# EAGLE design proj_controle (EAGLE 7.6.0)
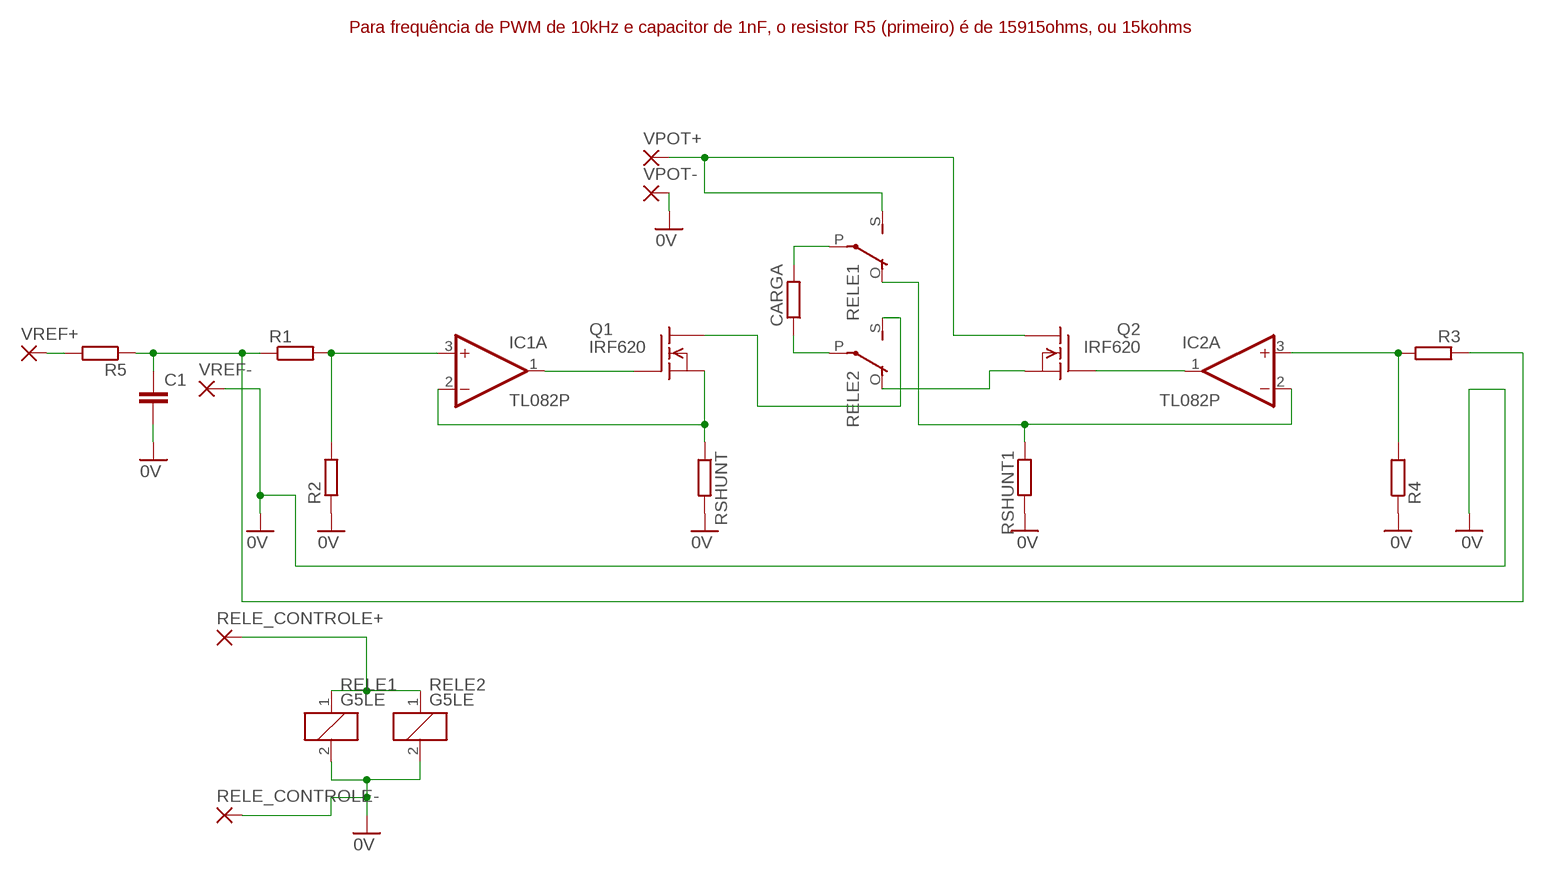
[diagram p0: schematic, sheet 1]

## Parts
C1  C-EU050-025X075  [C050-025X075]
CARGA  R-EU_0207/10  [0207/10]
IC1  TL082P  [DIL08]
IC2  TL082P  [DIL08]
Q1  IRF620  [TO220]
Q2  IRF620  [TO220]
R1  R-EU_0207/10  [0207/10]
R2  R-EU_0207/10  [0207/10]
R3  R-EU_0207/10  [0207/10]
R4  R-EU_0207/10  [0207/10]
R5  R-EU_0207/10  [0207/10]
RELE1  G5LE  [G5LE]
RELE2  G5LE  [G5LE]
RELE_CONTROLE+  3,17/1,1  [3,17/1,1]
RELE_CONTROLE-  3,17/1,1  [3,17/1,1]
RSHUNT  R-EU_0617/22  [0617/22]
RSHUNT1  R-EU_0617/22  [0617/22]
VPOT+  3,17/1,1  [3,17/1,1]
VPOT-  3,17/1,1  [3,17/1,1]
VREF+  3,17/1,1  [3,17/1,1]
VREF-  3,17/1,1  [3,17/1,1]

## Nets
0V: C1.2 R2.1 R4.1 RELE1.2 RELE2.2 RELE_CONTROLE-.1(P) RSHUNT1.2 RSHUNT.2 VPOT-.1(P) VREF-.1(P)
N$1: CARGA.1 RELE2.P(2:P)
N$2: IC1.3(A:+IN) R1.2 R2.2
N$3: IC1.1(A:OUT) Q1.1(G)
N$4: IC1.2(A:-IN) Q1.3(S) RSHUNT.1
N$5: C1.1 R1.1 R3.1 R5.1
N$6: R5.2 VREF+.1(P)
N$7: CARGA.2 RELE1.P(2:P)
N$8: Q1.2(D) RELE2.S(2:S)
N$9: IC2.3(A:+IN) R3.2 R4.2
N$10: IC2.1(A:OUT) Q2.1(G)
N$11: IC2.2(A:-IN) RELE1.O(2:O) RSHUNT1.1
N$13: Q2.2(D) RELE1.S(2:S) VPOT+.1(P)
N$14: Q2.3(S) RELE2.O(2:O)
N$15: RELE1.1 RELE2.1 RELE_CONTROLE+.1(P)
Unconnected: IC1.5(B:+IN) IC1.6(B:-IN) IC1.7(B:OUT) IC2.5(B:+IN) IC2.6(B:-IN) IC2.7(B:OUT)

## Notes on the sheet
- Para frequência de PWM de 10kHz e capacitor de 1nF, o resistor R5 (primeiro) é de 15915ohms, ou 15kohms

## Power pins joined to a net without a drawn wire
V+: IC1.8(P:V+) IC2.8(P:V+)
V-: IC1.4(P:V-) IC2.4(P:V-)

## Library data of the parts
C1 = rcl:C-EU: CAPACITOR, European symbol
CARGA R1-R5 = rcl:R-EU_: RESISTOR, European symbol
IC1 IC2 = linear:TL082: OP AMP Data sheet <http://www.ti.com/lit/ds/symlink/tl084a . pdf>; DATA_SHEET: <a href="http://www.ti.com/lit/ds/symlink/tl084a.pdf"> Data sheet </a>
Q1 Q2 = transistor-fet:IRF620: N-Channel Enhancement MOSFET (HEXFET); 200V; 5,2A; 0,8Ohm
RELE1 RELE2 = relay:G5LE: RELAY 1 x switch, 10 A/120 V AC, 8 A/30 V DC, Omron; OC_FARNELL: unknown; OC_NEWARK: unknown
RELE_CONTROLE+ RELE_CONTROLE- VPOT+ VPOT- VREF+ VREF- = wirepad:3,17/1,1: THROUGH-HOLE PAD
RSHUNT RSHUNT1 = resistor:R-EU_: RESISTOR, European symbol

## Board
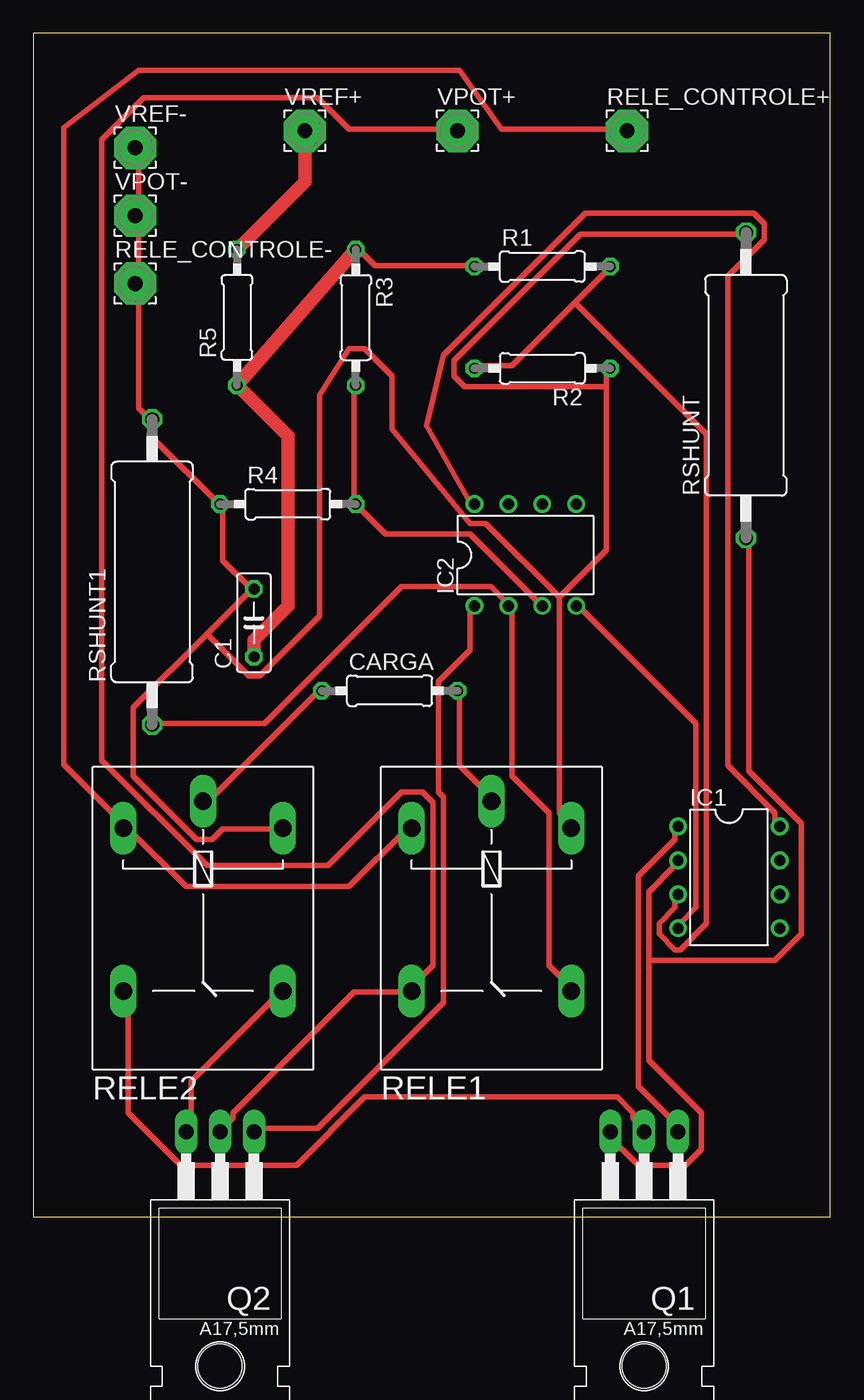
[diagram p1: board, top side]

Size 59.67 x 88.57 mm. Coordinates in mm from the lower left corner, seen from the top.
Outline: 0,0 59.67,0 59.67,88.57 0,88.57 0,0
Copper layers (1*16): Top 0.035mm / dielectric 1.5mm / Bottom 0.035mm
Design rules "default *": minimum track width 16mil, minimum drill 24mil, track to track 15mil, track to pad 15mil, pad to pad 15mil, via to via 15mil, smd to smd 8mil, copper to edge 40mil, drill to drill 8mil, minimum pad ring 10mil, minimum via ring 8mil, stop-mask expansion 4mil, vias tented up to drill 0mil, thermal gap 10mil

### Footprints (pad centres in the part's own frame; a part is rotated, then mirrored left to right if it is on the bottom)
C050-025X075 = drill 0.813 octagon: 1 -2.54,0; 2 2.54,0
0207/10 = drill 0.813 octagon: 1 -5.08,0; 2 5.08,0
DIL08 = drill 0.813 pad 1.27: 1 -3.81,-3.81; 2 -1.27,-3.81; 3 1.27,-3.81; 4 3.81,-3.81; 5 3.81,3.81; 6 1.27,3.81; 7 -1.27,3.81; 8 -3.81,3.81
TO220 = drill 1.118 long: 1 -2.54,-6.35; 2 0,-6.35; 3 2.54,-6.35 | hole 3.302: 0,11.176
G5LE = drill 1.321 long: 1 -7.493,-5.969; 2 -7.493,5.969; O 4.699,5.969; P -9.525,0; S 4.699,-5.969
3,17/1,1 = drill 1.118 pad 3.175 octagon: 1 0,0
0617/22 = drill 1.016 octagon: 1 -11.43,0; 2 11.43,0

### Placement (x,y rotation side)
C1  16.51,44.45 90 top
CARGA  26.67,39.37 0 top
IC1  52.07,25.4 270 top
IC2  36.83,49.53 0 top
Q1  45.72,0 180 top
Q2  13.97,0 180 top
R1  38.1,71.12 0 top
R2  38.1,63.5 180 top
R3  24.13,67.31 270 top
R4  19.05,53.34 0 top
R5  15.24,67.31 90 top
RELE1  34.29,21.59 270 top
RELE2  12.7,21.59 270 top
RELE_CONTROLE+  44.45,81.28 0 top
RELE_CONTROLE-  7.62,69.85 0 top
RSHUNT  53.34,62.23 90 top
RSHUNT1  8.89,48.26 90 top
VPOT+  31.75,81.28 0 top
VPOT-  7.62,74.93 0 top
VREF+  20.32,81.28 0 top
VREF-  7.62,80.01 0 top

### Tracks (layer width: path | path; a pad name or v marks a point on that pad's centre or on a via)
0V
  Top 0.406: 42.91,62.12 42.91,49.91 39.37,46.37 | 42.91,62.12 42.91,63.3 R2.1 | 39.37,46.37 39.37,30.23 40.16,29.44 RELE1.2 | 42.91,62.12 32.28,62.12 31.5,62.9 31.5,64.08 40.95,73.53 53.15,73.53 RSHUNT.2 | VREF-.1 7.87,79.83 7.87,75.11 VPOT-.1 7.87,74.71 7.87,69.99 RELE_CONTROLE-.1 7.87,69.6 7.87,60.54 8.66,59.75 RSHUNT1.2 9.05,59.36 9.05,58.18 13.78,53.45 R4.1 14.17,53.06 14.17,49.12 16.14,47.15 C1.2 16.14,46.76 12.99,43.61 | 12.99,43.61 7.48,38.1 7.48,32.98 12.21,28.26 13.39,28.26 14.17,29.05 18.5,29.05 RELE2.2 | 39.37,46.37 33.86,51.88 32.68,51.88 26.86,58.97 26.86,62.9 24.8,64.96 23.62,64.96 21.44,61.51 21.44,44.97 16.93,40.46 16.14,40.46 12.99,43.61
N$1
  Top 0.406: CARGA.1 21.26,39.28 12.99,31.01 RELE2.P
N$2
  Top 0.406: 40.55,68.42 42.91,70.78 R1.2 | 40.55,68.42 35.83,63.69 33.07,63.69 R2.2 | 40.55,68.42 50.39,58.57 50.39,21.96 48.42,19.99 48.03,19.99 46.85,21.17 46.85,21.96 48.03,23.14 48.03,23.93 IC1.3
N$3
  Top 0.406: IC1.1 48.03,29.05 48.03,28.26 45.28,25.5 45.28,9.75 48.42,6.6 Q1.1
N$4
  Top 0.406: 46.06,19.2 46.06,11.72 50,7.79 50,5.03 48.82,3.85 45.28,3.85 42.91,6.21 Q1.3 | 46.06,19.2 46.06,24.32 48.03,26.29 IC1.2 | 46.06,19.2 55.51,19.2 57.48,21.17 57.48,29.44 53.54,33.38 53.54,50.7 RSHUNT.1
N$5
  Top 0.406: R1.1 32.68,71.17 25.59,71.17 24.41,72.35 R3.1
  Top 1.016: R3.1 R5.1 19.05,58.42 19.05,45.72 16.51,43.18 C1.1
N$6
  Top 1.016: VREF+.1 20.32,77.47 R5.2
N$7
  Top 0.406: CARGA.2 31.89,39.28 31.89,33.77 34.25,31.41 RELE1.P
N$8
  Top 0.406: Q1.2 45.67,6.6 44.88,7.39 44.88,7.79 43.7,8.97 24.8,8.97 19.68,3.85 11.02,3.85 7.09,7.79 7.09,16.84 RELE2.S
N$9
  Top 0.406: R3.2 24.02,62.12 24.02,53.45 R4.2 26.38,51.09 32.68,51.09 37.8,45.97 IC2.3
N$10
  Top 0.406: IC2.1 32.68,45.58 32.68,42.43 30.32,40.07 30.32,31.8 30.71,31.41 30.71,16.05 21.26,6.6 16.54,6.6 Q2.1
N$11
  Top 0.406: RELE1.O 40.16,17.23 38.58,18.81 38.58,30.23 35.83,32.98 35.83,45.58 IC2.2 35.43,45.97 34.25,47.15 27.56,47.15 17.32,36.92 9.05,36.92 RSHUNT1.1
N$13
  Top 0.406: Q2.2 14.17,6.6 14.96,7.39 14.96,7.79 24.02,16.84 27.95,16.84 RELE1.S 28.35,17.23 29.92,18.81 29.92,31.01 29.13,31.8 27.56,31.8 22.05,26.29 12.99,26.29 5.12,34.16 5.12,80.62 8.27,83.77 21.26,83.77 23.62,81.41 31.5,81.41 VPOT+.1
N$14
  Top 0.406: Q2.3 11.81,6.6 11.81,10.15 18.5,16.84 RELE2.O
N$15
  Top 0.406: RELE1.1 27.95,29.05 23.62,24.71 11.42,24.71 7.09,29.05 RELE2.1 6.69,29.44 2.27,33.86 2.27,81.5 7.87,85.83 31.89,85.83 35.04,81.41 44.09,81.41 RELE_CONTROLE+.1
V+
  Top 0.406: IC1.8 55.51,29.44 55.51,30.23 51.97,33.77 51.97,70.38 54.72,73.14 54.72,74.32 53.94,75.11 41.34,75.11 30.71,64.48 29.44,59.23 32.68,53.45 IC2.8
V-
  Top 0.406: IC1.4 48.42,21.96 49.61,23.14 49.61,36.92 40.95,45.58 IC2.4